# Altium project Low noise PSU.PrjPcb
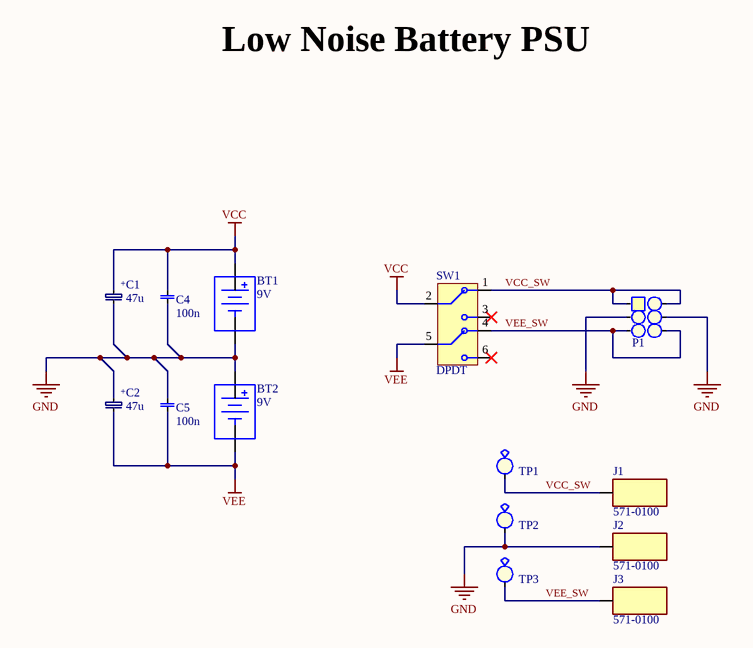
[diagram p0: Low noise PSU.SchDoc]
Revision: 0.1; Title: Low Noise PSU
1 sheet, 14 parts. Net scope: global (net labels, ports and power ports of the same name join across sheets).
Board file: Low noise PSU.PcbDoc

## Sheet Low noise PSU.SchDoc: Low Noise PSU
size A4; SheetNumber: 1; SheetTotal: 1

### Parts
BT1  9V  [Battery_Holder_9V]
BT2  9V  [Battery_Holder_9V]
C1  value 47u  [Capacitor TH 6.3x12.5mm P2.5mm]  (hidden comment: Capacitor, TH Polarized)
C2  value 47u  [Capacitor TH 6.3x12.5mm P2.5mm]  (hidden comment: Capacitor, TH Polarized)
C4  value 100n  [0805, cap]  (hidden comment: 0805, capacitor)
C5  value 100n  [0805, cap]  (hidden comment: 0805, capacitor)
J1  571-0100  [Banana Conn VCC]
J2  571-0100  [Banana Conn VCC]
J3  571-0100  [Banana Conn VCC]
P1  2x3 Pin Header  [2x3 PH]  (value not drawn)
SW1  DPDT  [SW_DPDT_MTS-202-A2]
TP1  Test Point  [TESTPOINT_SMD]  (value not drawn)
TP2  Test Point  [TESTPOINT_SMD]  (value not drawn)
TP3  Test Point  [TESTPOINT_SMD]  (value not drawn)

### Nets
GND: BT1.N(NEG) BT2.P(POS) C1.1 C2.2 C4.2 C5.1 J2.1 P1.2 P1.5 TP2.0
VCC: BT1.P(POS) C1.2 C4.1 SW1.2
VEE: BT2.N(NEG) C2.1 C5.2 SW1.5
VCC_SW: J1.1 P1.1 P1.6 SW1.1 TP1.0
VEE_SW: J3.1 P1.3 P1.4 SW1.4 TP3.0

Not connected (* = marked no-connect by the designer): SW1 3* 6*

### Notes on the sheet
- Low Noise Battery PSU
- TITLE:
- REV:
- DOCUMENT:
- noxet
- DATE:
- (in symbol Capacitor, TH Polarized) +

### Library data of the parts
BT1 BT2 = Battery Holder 9V: Electrokit art nr: 41003388
C1 C2 = Capacitor, TH Polarized: Capacitor TH Polarized; Order number: 3335618; Supplier: Farnell
J1-J3 = Banana conn: Banana Connector 571-0100; Manufacturer_Name: Deltron; Datasheet Link: https://www.dem-uk.com/deltron-components/Data/Product_Downloads/deltron-571-0100-4mm-90deg-single-socket-data.pdf; Height: 12.4mm; Manufacturer_Part_Number: 571-0100; Mouser Part Number: 164-6218; Mouser Price/Stock: https://www.mouser.com/Search/Refine.aspx?Keyword=164-6218
P1 = 2x3 Pin Header: Value: 2x3 Pin Header, 2.54mm
SW1 = Switch DPDT: Toggle switch DPDT
TP1-TP3 = Test Point: Value: Test point; Farnell: 1702006